# Altium schematic sheet AC Circuitry.SchDoc
size A3; SheetNumber: 4; SheetTotal: 6
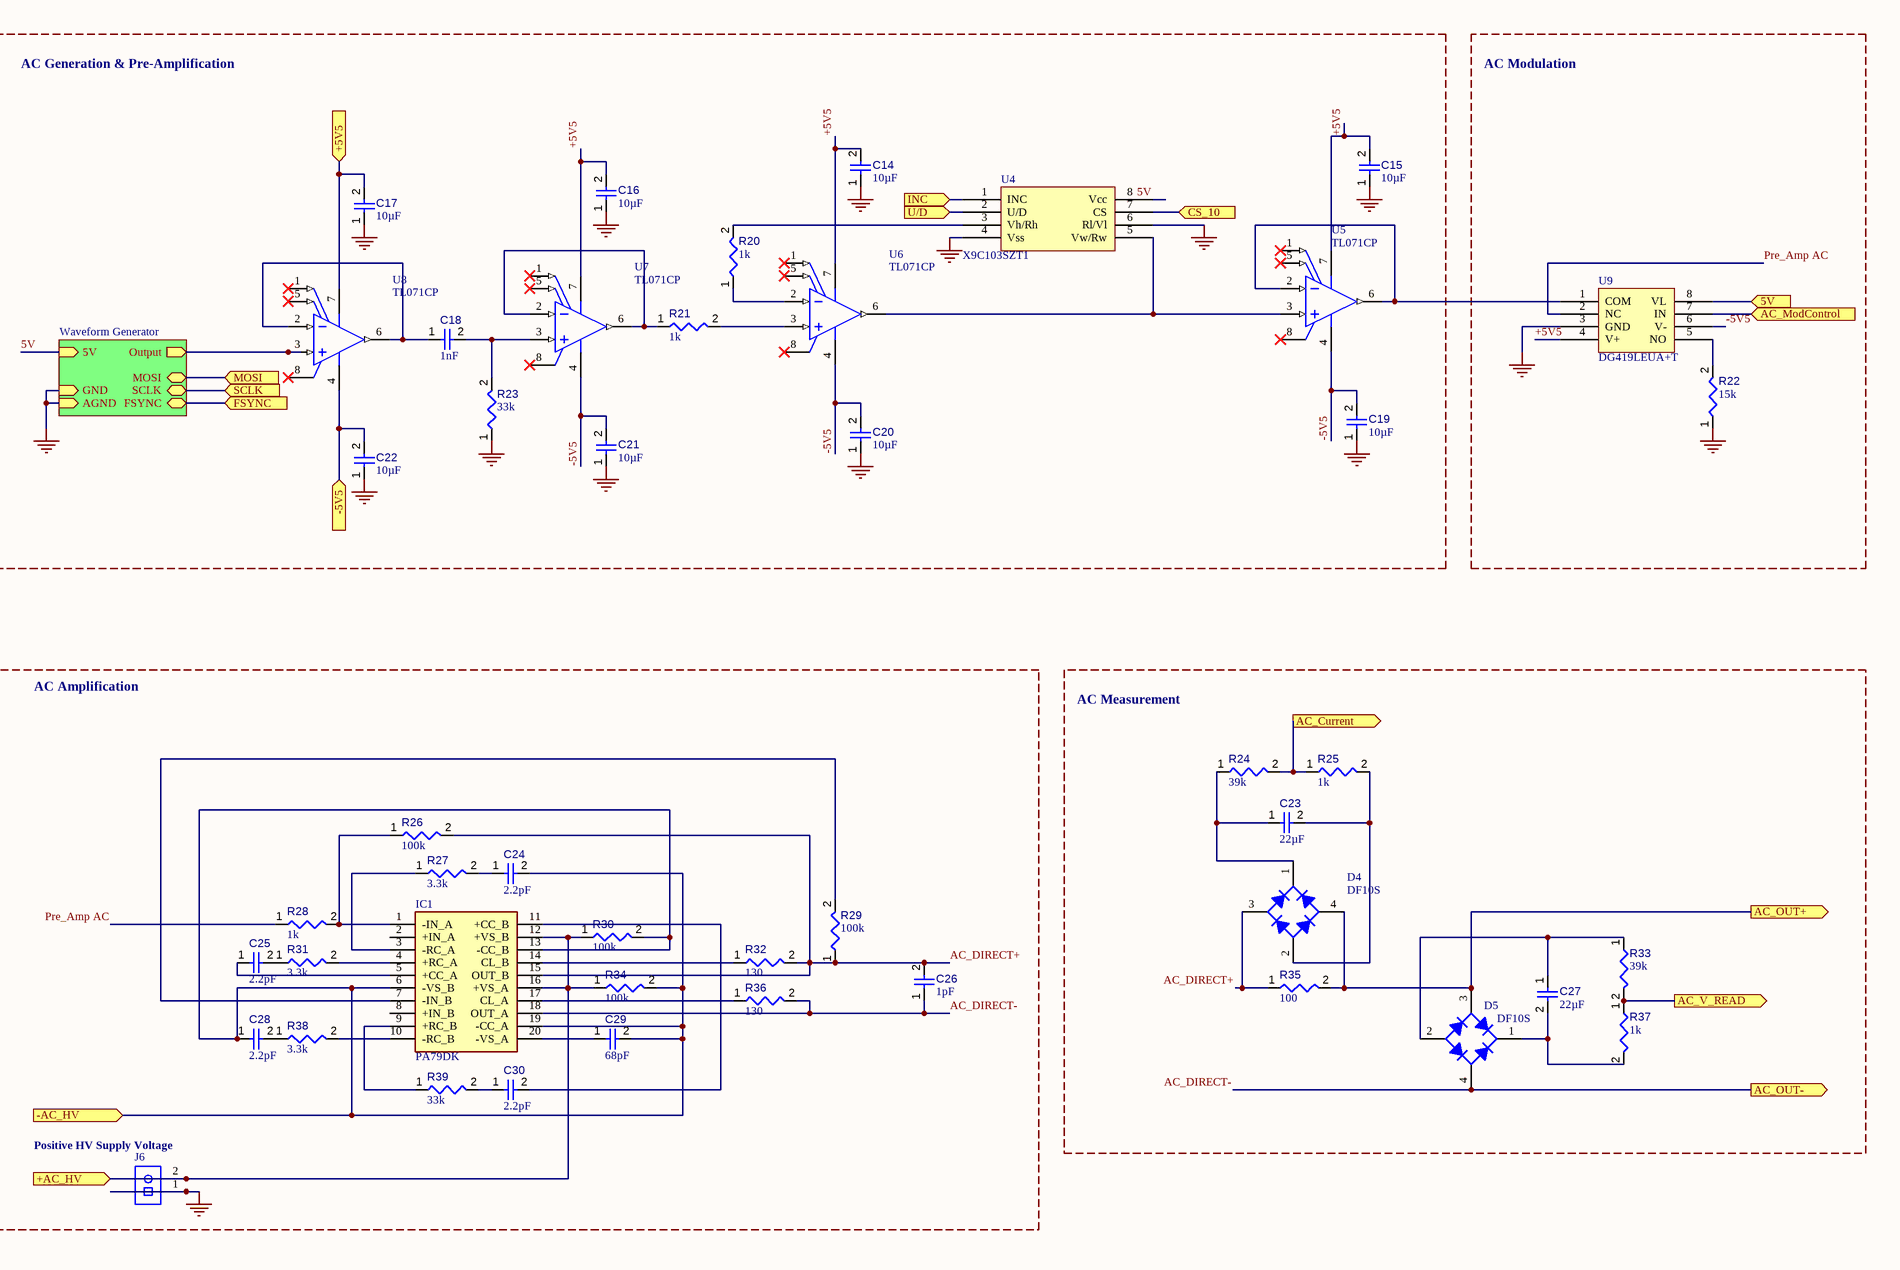
[diagram p0: AC Circuitry.SchDoc, right]

## Parts
C14  value 10µF  [FP-SR20-MFG]  (hidden comment: SR205C104KAR)
C15  value 10µF  [FP-SR20-MFG]  (hidden comment: SR205C104KAR)
C16  value 10µF  [FP-SR20-MFG]  (hidden comment: SR205C104KAR)
C17  value 10µF  [FP-SR20-MFG]  (hidden comment: SR205C104KAR)
C18  value 1nF  [CAPC0402(1005)33_L]  (hidden comment: Capacitor 1nF +/-20% 50V 0402)
C19  value 10µF  [FP-SR20-MFG]  (hidden comment: SR205C104KAR)
C20  value 10µF  [FP-SR20-MFG]  (hidden comment: SR205C104KAR)
C21  value 10µF  [FP-SR20-MFG]  (hidden comment: SR205C104KAR)
C22  value 10µF  [FP-SR20-MFG]  (hidden comment: SR205C104KAR)
C23  value 22µF  [CAPC0805(2012)145_L]  (hidden comment: Capacitor 22µF +/-40% 16V 0805)
C24  value 2.2pF  [FP-CBR06C-MFG]  (hidden comment: CBR06C229CAGAC)
C25  value 2.2pF  [FP-CBR06C-MFG]  (hidden comment: CBR06C229CAGAC)
C26  value 1pF  [FP-C0603C-CF-IPC_B]  (hidden comment: C0603C109C1GACTU)
C27  value 22µF  [CAPC0805(2012)145_L]  (hidden comment: Capacitor 22µF +/-40% 16V 0805)
C28  value 2.2pF  [FP-CBR06C-MFG]  (hidden comment: CBR06C229CAGAC)
C29  value 68pF  [CAPC2013X127X50NL20T25]  (hidden comment: 08052A680JAT2A)
C30  value 2.2pF  [FP-CBR06C-MFG]  (hidden comment: CBR06C229CAGAC)
D4  DF10S  [FAIR-SDIP-4_V]
D5  DF10S  [FAIR-SDIP-4_V]
IC1  PA79DK  [PA162DK]
J6  1729128  [PHOE-1729128-2_V]  (value not drawn)
R20  value 1k  [RESA60-630X240]  (hidden comment: MFR-25FBF52-1K)
R21  value 1k  [RESA60-630X240]  (hidden comment: MFR-25FBF52-1K)
R22  value 15k  [RESC1005X40X25ML10T10]  (hidden comment: Resistor 15k +/-1% 0402 63 mW)
R23  value 33k  [RESC1005X40X25ML10T10]  (hidden comment: Resistor 33k +/-5% 0402 63 mW)
R24  value 39k  [RESC3216X70X50NL05T20]  (hidden comment: ERJ-8ENF3902V)
R25  value 1k  [RESA60-630X240]  (hidden comment: MFR-25FBF52-1K)
R26  value 100k  [RESC3216X60X45ML15T20]  (hidden comment: Resistor 100k +/-1% 1206 250 mW)
R27  value 3.3k  [RESC3116X70X50ML13T20]  (hidden comment: ERJ-8ENF3301V)
R28  value 1k  [RESA60-630X240]  (hidden comment: MFR-25FBF52-1K)
R29  value 100k  [RESC3216X60X45ML15T20]  (hidden comment: Resistor 100k +/-1% 1206 250 mW)
R30  value 100k  [RESC3216X60X45ML15T20]  (hidden comment: Resistor 100k +/-1% 1206 250 mW)
R31  value 3.3k  [RESC3116X70X50ML13T20]  (hidden comment: ERJ-8ENF3301V)
R32  value 130  [RESC1608X55X30LL15T15]  (hidden comment: ERJ-3EKF1300V)
R33  value 39k  [RESC3216X70X50NL05T20]  (hidden comment: ERJ-8ENF3902V)
R34  value 100k  [RESC3216X60X45ML15T20]  (hidden comment: Resistor 100k +/-1% 1206 250 mW)
R35  value 100  [RESA60-630X240]  (hidden comment: MFR-25FBF52-100R)
R36  value 130  [RESC1608X55X30LL15T15]  (hidden comment: ERJ-3EKF1300V)
R37  value 1k  [RESA60-630X240]  (hidden comment: MFR-25FBF52-1K)
R38  value 3.3k  [RESC3116X70X50ML13T20]  (hidden comment: ERJ-8ENF3301V)
R39  value 33k  [RESC1005X40X25ML10T10]  (hidden comment: Resistor 33k +/-5% 0402 63 mW)
U4  X9C103SZT1  [SOIC127P600X175-8N]
U5  TL071CP  [P0008A]
U6  TL071CP  [P0008A]
U7  TL071CP  [P0008A]
U8  TL071CP  [P0008A]
U9  DG419LEUA+T  [SOIC127P600X175-8N]

## Blocks framed on the sheet
AC Generation & Pre-Amplification: C14-C22 R20 R21 R23 U4-U8
AC Modulation: R22 U9
AC Amplification: C24-C26 C28-C30 IC1 J6 R26-R32 R34 R36 R38 R39
AC Measurement: C23 C27 D4 D5 R24 R25 R33 R35 R37

## Sub-sheets
Waveform Generator = Negative Voltage Supply.SchDoc: Output (out), AGND (in), FSYNC (bidir), MOSI (bidir), SCLK (bidir), GND (in), 5V (in)

## Ports
5V (in), +5V5 (in), +AC_HV (in), -5V5 (in), -AC_HV (in), AC_Current (out), AC_ModControl (in), AC_OUT+ (out), AC_OUT- (out), AC_V_READ (out), CS_10 (in), FSYNC (in), INC (in), MOSI (in), SCLK (in), U/D (in)

## Nets
GND: C14.1 C15.1 C16.1 C17.1 C19.1 C20.1 C21.1 C22.1 J6.1 R22.1 R23.1 U4.4(Vss) U4.6(Rl/Vl) U9.3(GND) ; sheet Waveform Generator/AGND, sheet Waveform Generator/GND
5V: U4.8(Vcc) ; sheet Waveform Generator/5V
5V: U9.8(VL) ; port 5V  [a separate net that carries the same name]
+5V5: C17.2 U8.7(VCC+) ; port +5V5
+5V5: C14.2 C15.2 C16.2 U5.7(VCC+) U6.7(VCC+) U7.7(VCC+) U9.4(V+)  [a separate net that carries the same name]
+AC_HV: IC1.12(+VS_B) IC1.16(+VS_A) J6.2 R30.1 R34.1 ; port +AC_HV
-5V5: C22.2 U8.4(VCC-) ; port -5V5
-5V5: C19.2 C20.2 C21.2 U5.4(VCC-) U6.4(VCC-) U7.4(VCC-) U9.6(V-)  [a separate net that carries the same name]
-AC_HV: C24.2 C28.1 C29.2 IC1.6(-VS_B) IC1.13(-CC_B) IC1.19(-CC_A) R30.2 R34.2 ; port -AC_HV
AC_Current: R24.2 R25.1 ; port AC_Current
AC_DIRECT+: C26.2 D4.3(C) IC1.15(OUT_B) R26.2 R29.1 R32.2 R35.1
AC_DIRECT-: C26.1 D5.4(C) IC1.18(OUT_A) R36.2 ; port AC_OUT-
AC_ModControl: U9.7(IN) ; port AC_ModControl
AC_OUT+: D4.4(C) D5.3(C) R35.2 ; port AC_OUT+
AC_V_READ: R33.2 R37.1 ; port AC_V_READ
CS_10: U4.7(CS) ; port CS_10
FSYNC: port FSYNC, sheet Waveform Generator/FSYNC
INC: U4.1(INC) ; port INC
MOSI: port MOSI, sheet Waveform Generator/MOSI
Pre_Amp AC: R28.1 U9.2(NC)
SCLK: port SCLK, sheet Waveform Generator/SCLK
U/D: U4.2(U/D) ; port U/D
NetC18_1: C18.1 U8.2(IN-) U8.6(OUT)
NetC18_2: C18.2 R23.2 U7.3(IN+)
NetC23_1: C23.1 D4.1(K) R24.1
NetC23_2: C23.2 D4.2(A) R25.2
NetC24_1: C24.1 R27.2
NetC25_1: C25.1 IC1.5(+CC_A)
NetC25_2: C25.2 R31.1
NetC27_1: C27.1 D5.2(A) R33.1
NetC27_2: C27.2 D5.1(K) R37.2
NetC28_2: C28.2 R38.1
NetC29_1: C29.1 IC1.20(-VS_A)
NetC30_1: C30.1 R39.2
NetC30_2: C30.2 IC1.11(+CC_B)
NetIC1_1: IC1.1(-IN_A) R26.1 R28.2
NetIC1_3: IC1.3(-RC_A) R27.1
NetIC1_4: IC1.4(+RC_A) R31.2
NetIC1_7: IC1.7(-IN_B) R29.2
NetIC1_9: IC1.9(+RC_B) R39.1
NetIC1_10: IC1.10(-RC_B) R38.2
NetIC1_14: IC1.14(CL_B) R32.1
NetIC1_17: IC1.17(CL_A) R36.1
NetR20_1: R20.1 U6.2(IN-)
NetR20_2: R20.2 U4.3(Vh/Rh)
NetR21_1: R21.1 U7.2(IN-) U7.6(OUT)
NetR21_2: R21.2 U6.3(IN+)
NetR22_2: R22.2 U9.5(NO)
NetU4_5: U4.5(Vw/Rw) U5.3(IN+) U6.6(OUT)
NetU5_2: U5.2(IN-) U5.6(OUT) U9.1(COM)
NetU8_3: U8.3(IN+) ; sheet Waveform Generator/Output

Not connected (* = marked no-connect by the designer): IC1 2(+IN_A) 8(+IN_B); U5 1(OFFSET_N1)* 5(OFFSET_N2)* 8(NC)*; U6 1(OFFSET_N1)* 5(OFFSET_N2)* 8(NC)*; U7 1(OFFSET_N1)* 5(OFFSET_N2)* 8(NC)*; U8 1(OFFSET_N1)* 5(OFFSET_N2)* 8(NC)*

## Notes on the sheet
- (near J6) Positive HV Supply Voltage

## Library data of the parts
C14-C17 C19-C22 = CMP-001-00094-1: Ceramic Capacitor, Multilayer, Ceramic, 50V, 10% +Tol, 10% -Tol, X7R, 15% TC, 10uF, Through Hole Mount; Min Operating Temperature: -55°C; Max Operating Temperature: 125°C; RoHS Compliant: Yes; Mounting Technology: Through Hole; Pins: 2; Capacitor Type: Ceramic
C18 = CMP-001-00066-3: Chip Capacitor, 1nF +/-20%, 50V, 0402, Thickness 0.33 mm; Tolerance: 10%; Case/Package: 0402; Pins: 2; Min Operating Temperature: -55°C; Max Operating Temperature: 85°C; Voltage Rating: 50V; Mounting Technology: SMT
C23 C27 = CMP-001-00081-4: Chip Capacitor, 22µF +/-40%, 16V, 0805, Thickness 1.45 mm; Tolerance: 5%; Voltage Rating: 16V; Mounting Technology: SMT; Pins: 2; Max Operating Temperature: 85°C; Case/Package: 0805; Min Operating Temperature: -55°C
C24 C25 C28 C30 = CMP-001-00092-1: Ceramic Capacitor, Multilayer, Ceramic, 250V, 11.3636% +Tol, 11.3636% -Tol, C0G, -/+30ppm/Cel TC, 0.0000022uF, Surface Mount, 0603; Mounting Technology: Surface Mount; Max Operating Temperature: 125°C; Min Operating Temperature: -55°C; Pins: 2; RoHS Compliant: Yes; Capacitor Type: Ceramic; Case/Package: 0603
C26 = CMP-001-00095-1: Ceramic Capacitor, Multilayer, Ceramic, 100V, 25% +Tol, 25% -Tol, C0G, 30ppm/Cel TC, 0.000001uF, Surface Mount, 0603; Pins: 2; Max Operating Temperature: 125°C; RoHS Compliant: Yes; Mounting Technology: Surface Mount; Case/Package: 0603; Capacitor Type: Ceramic; Min Operating Temperature: -55°C
C29 = CMP-001-00096-1: Ceramic Capacitor, Multilayer, Ceramic, 200V, 5% +Tol, 5% -Tol, C0G, 30ppm/Cel TC, 0.000068uF, Surface Mount, 0805; Pins: 2; RoHS Compliant: Yes; Case/Package: 0805; Min Operating Temperature: -55°C; Mounting Technology: Surface Mount; Max Operating Temperature: 125°C; Capacitor Type: Ceramic
D4 D5 = CMP-00001-1: Bridge Rectifier Diode, 1 Phase, 1.5A, 1000V V(RRM), Silicon; Diode Type: RECTIFIER; Reach SVHC Compliant: No; RoHS Compliant: Yes
IC1 = PA79DK: Integrated Circuit; Manufacturer_Name: Apex Microtechnology; Datasheet Link: https://www.apexanalog.com/resources/products/pa79u.pdf; Height: 3.4mm; Manufacturer_Part_Number: PA79DK; Mouser Part Number: 137-PA79DK; Mouser Price/Stock: https://www.mouser.co.uk/ProductDetail/Apex-Microtechnology/PA79DK?qs=TiOZkKH1s2SJIu0dSiB8Ng%3D%3D; Simulation Data: https://www.apexanalog.com/resources/spicemodels/PA79.zip
J6 = CMP-002-00077-1: Barrier Strip Terminal Block, 13.5A, 1.5mm2, 1 Row(s), 1 Deck(s); Voltage Rating: 400V; RoHS Compliant: Yes; Mounting Technology: Board
R20 R21 = CMP-009-00195-1: Fixed Resistor, Metal Film, 0.25W, 1000ohm, 250V, 1% +/-Tol, 100ppm/Cel, Through Hole Mount; Power: 250mW; Tolerance: 1%; RoHS Compliant: Yes; Min Operating Temperature: -55°C; Max Operating Temperature: 155°C; Mounting Technology: Through Hole; Pins: 2
R22 = CMP-009-00026-5: Chip Resistor, 15 KOhm, +/- 1%, 0.063 W, -55 to 155 degC, 0402 (1005 Metric); Power: 63mW; Min Operating Temperature: -55°C; Tolerance: 1%; Max Operating Temperature: 155°C; Mounting Technology: SM; Case/Package: 0402; RoHS Compliant: True; Pins: 2
R23 R39 = CMP-009-00028-5: Chip Resistor, 33 KOhm, +/- 5%, 0.063 W, -55 to 155 degC, 0402 (1005 Metric); Power: 63mW; Tolerance: 5%; Case/Package: 0402; Mounting Technology: SM; Min Operating Temperature: -55°C; Max Operating Temperature: 155°C; Pins: 2; RoHS Compliant: True
R24 R33 = CMP-009-00186-1: Fixed Resistor, Metal Glaze/thick Film, 0.25W, 39kohm, 200V, 1% +/-Tol, 100ppm/Cel, Surface Mount, 1206; Power: 250mW; Min Operating Temperature: -55°C; Max Operating Temperature: 155°C; Case/Package: 1206; Pins: 2; RoHS Compliant: Yes; Mounting Technology: Surface Mount; Tolerance: 1%
R25 R28 R37 = CMP-009-00048-4: Axial Resistor, 1 KOhm, +/- 1%, 250 mW, -55 to 155 degC, 2-Pin THD, RoHS, Bulk; Manufacturer: Yageo; Voltage Rating: 250V; Power: 250mW; Min Operating Temperature: -55°C; Max Operating Temperature: 155°C; Tolerance: 1%; Package Reference: MFR-25; Composition: CarbonFilm; Mounting Technology: TH; Packaging: Bulk; Case/Package: Axial; Datasheet URL: http://www.yageo.com/documents/recent/Yageo%20LR_MFR_2013.pdf; Package Quantity: 200; Manufacturer URL: http://www.yageo.com/; Package Description: 2-Pin Axial Lead, Dia 2.4 mm, Body Length 6.3 mm; Datasheet Version: Apr-13; RoHS Compliant: True
R26 R29 R30 R34 = CMP-009-00025-5: Chip Resistor, 100 KOhm, +/- 1%, 0.25 W, -55 to 155 degC, 1206 (3216 Metric); Voltage Rating: 200V; Power: 250mW; RoHS Compliant: True; Max Operating Temperature: 155°C; Pins: 2; Tolerance: 1%; Mounting Technology: SM; Case/Package: 1206; Min Operating Temperature: -55°C
R27 R31 R38 = CMP-009-00192-1: Fixed Resistor, Metal Glaze/thick Film, 0.25W, 3300ohm, 200V, 1% +/-Tol, 100ppm/Cel, Surface Mount, 1206; Power: 250mW; Pins: 2; Mounting Technology: Surface Mount; Max Operating Temperature: 155°C; Tolerance: 1%; Case/Package: 1206; Min Operating Temperature: -55°C; RoHS Compliant: Yes
R32 R36 = CMP-009-00196-1: Fixed Resistor, Metal Glaze/thick Film, 0.1W, 130ohm, 75V, 1% +/-Tol, 100ppm/Cel, Surface Mount, 0603; Power: 100mW; Max Operating Temperature: 155°C; Min Operating Temperature: -55°C; Tolerance: 1%; Pins: 2; Mounting Technology: Surface Mount; Case/Package: 0603; RoHS Compliant: Yes
R35 = CMP-009-00046-4: Axial Resistor, 100 Ohm, +/- 1%, 0.25 W, -55 to 155 degC, 2-Pin THD, RoHS, Bulk; Manufacturer: Yageo; Voltage Rating: 250V; Power: 250mW; Packaging: Bulk; Max Operating Temperature: 155°C; Mounting Technology: TH; Datasheet Version: Apr-13; Case/Package: Axial; RoHS Compliant: True; Package Description: 2-Pin Axial Lead, Dia 2.4 mm, Body Length 6.3 mm; Package Quantity: 200; Package Reference: MFR-25; Tolerance: 1%; Composition: CarbonFilm; Datasheet URL: http://www.yageo.com/documents/recent/Yageo%20LR_MFR_2013.pdf; Manufacturer URL: http://www.yageo.com/; Min Operating Temperature: -55°C
U4 = CMP-009-00197-1: Digital Potentiometer, 1 Func, 10000ohm, Increment/decrement Control Interface, 100 Positions, CMOS, PDSO8; Pins: 8; Min Operating Temperature: 0°C; Case/Package: SOP; Max Operating Temperature: 70°C; RoHS Compliant: Yes
U5-U8 = CMP-014-00004-1: Operational Amplifier, 1 Func, 6000uV Offset-Max, BIPolar, PDIP8; Nominal Supply Voltage: 15V; Channels: 1; Max Operating Temperature: 70°C; Pins: 8; RoHS Compliant: Yes; Case/Package: DIP; Min Operating Temperature: 0°C
U9 = CMP-011-00016-1: SPDT, 1 Func, 1 Channel, CMOS, PDSO8; Pins: 8; Min Operating Temperature: -40°C; RoHS Compliant: Yes; Throw Configuration: SPDT; Case/Package: TSSOP; Max Operating Temperature: 85°C